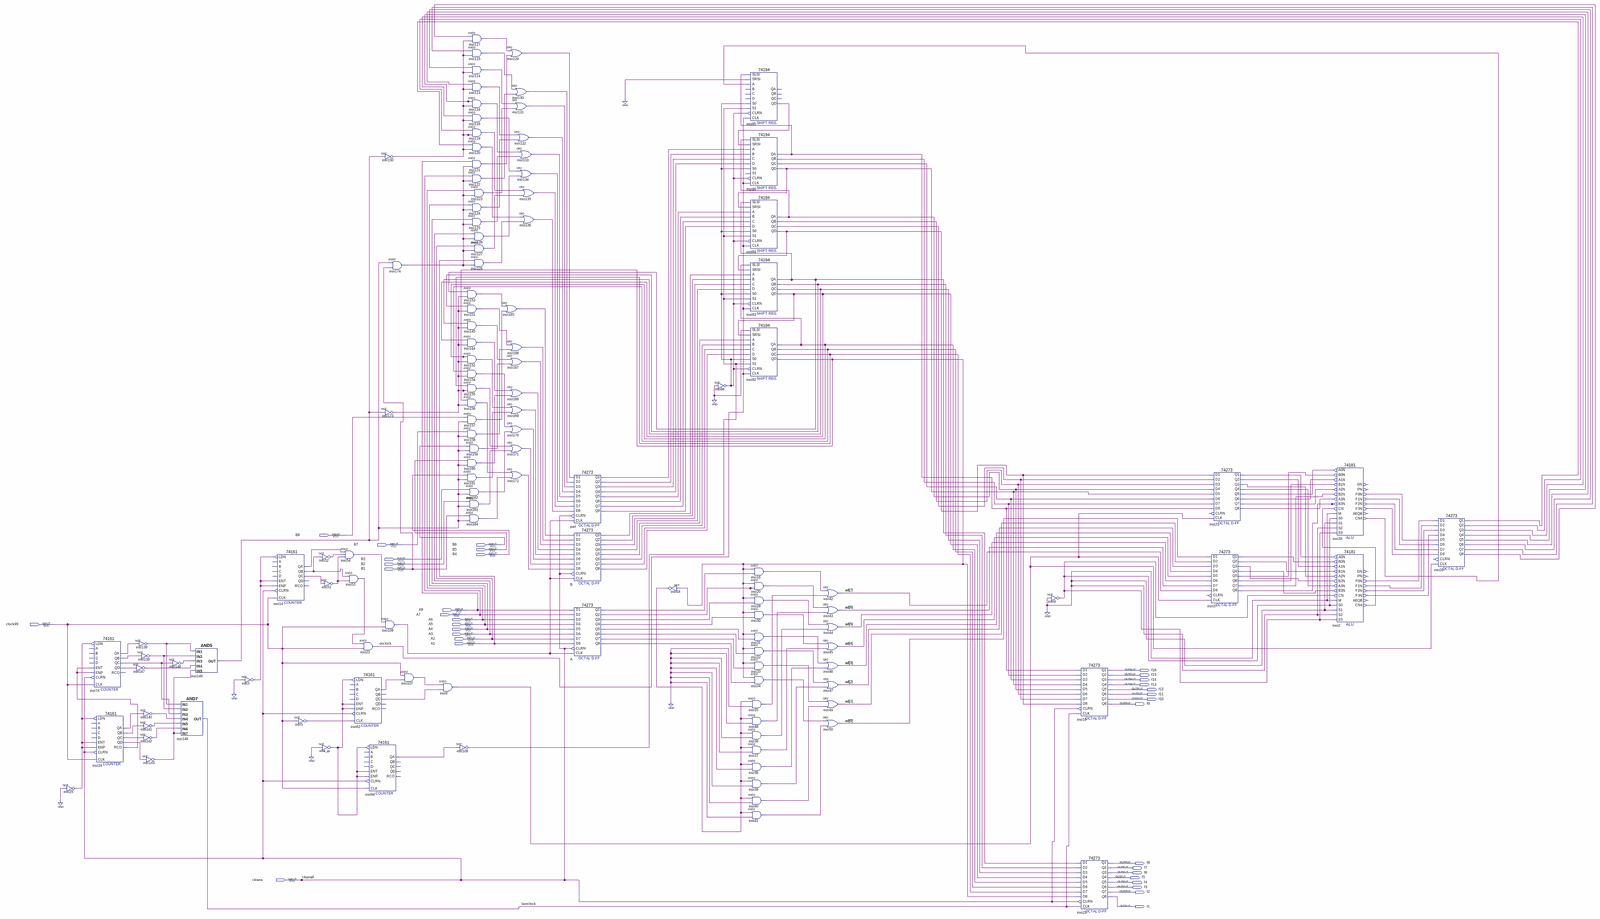
[diagram p0: schematic sheet, whole]
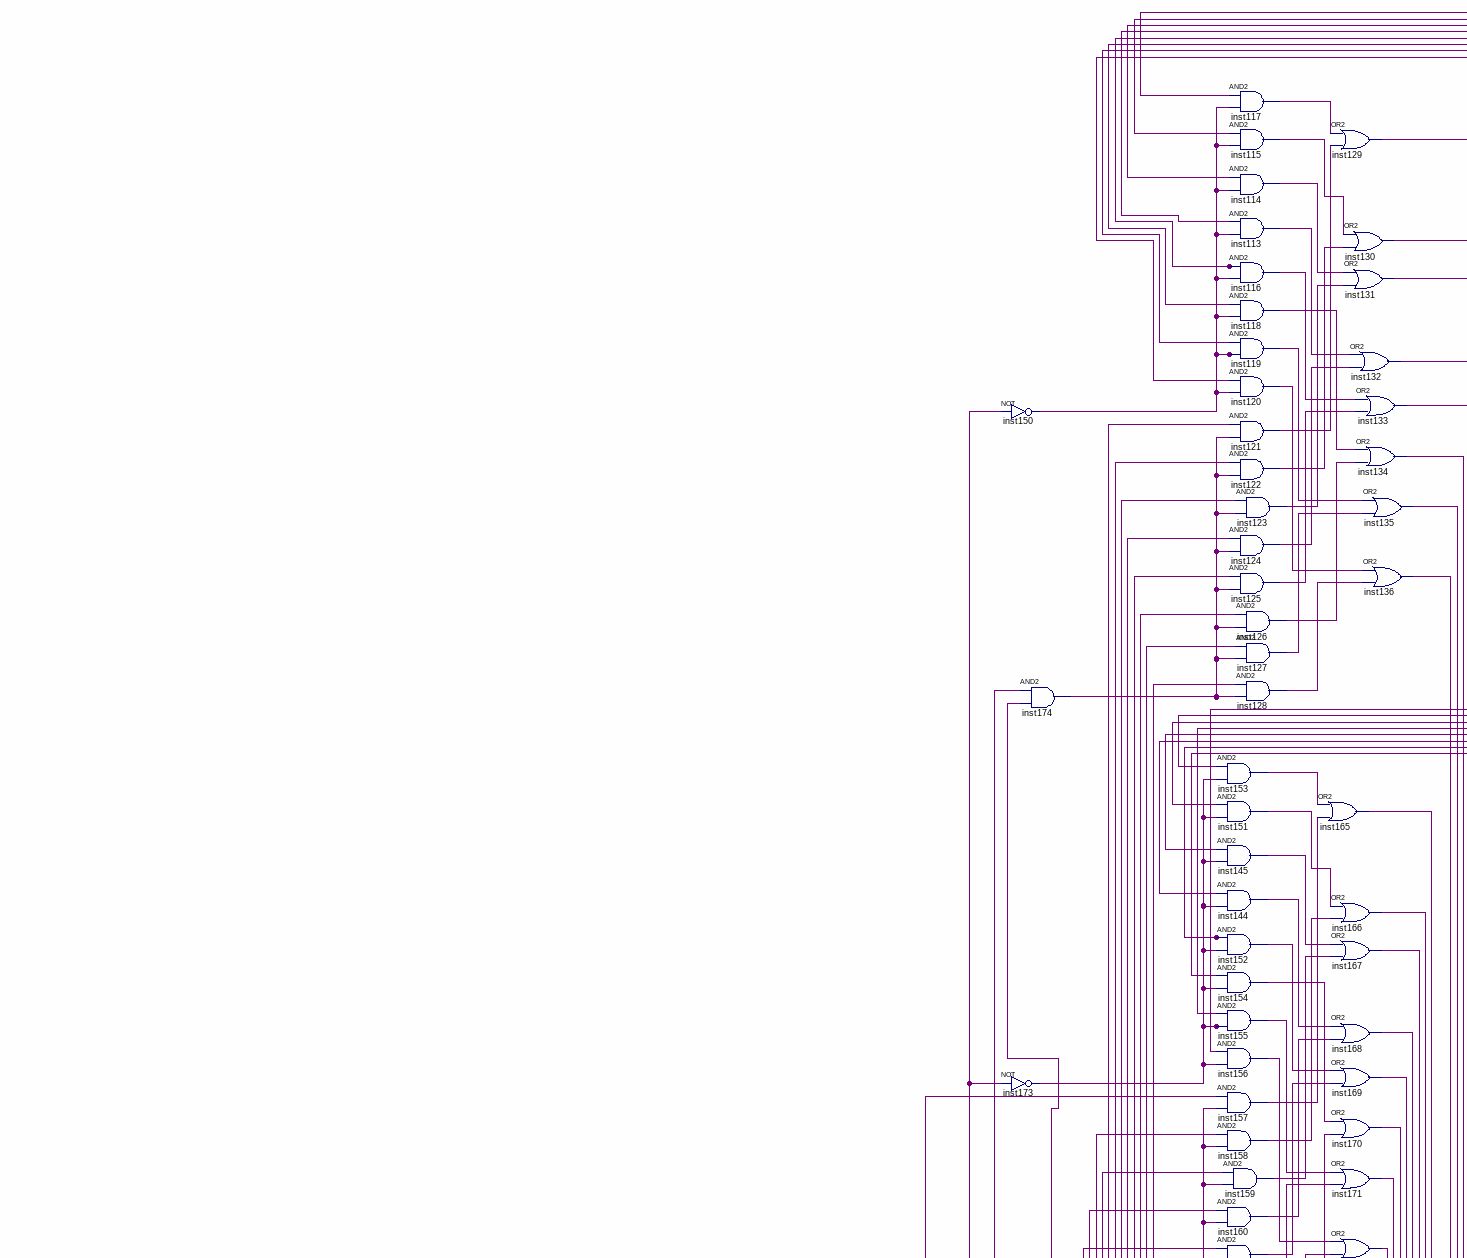
[diagram p1: schematic sheet, upper left part]
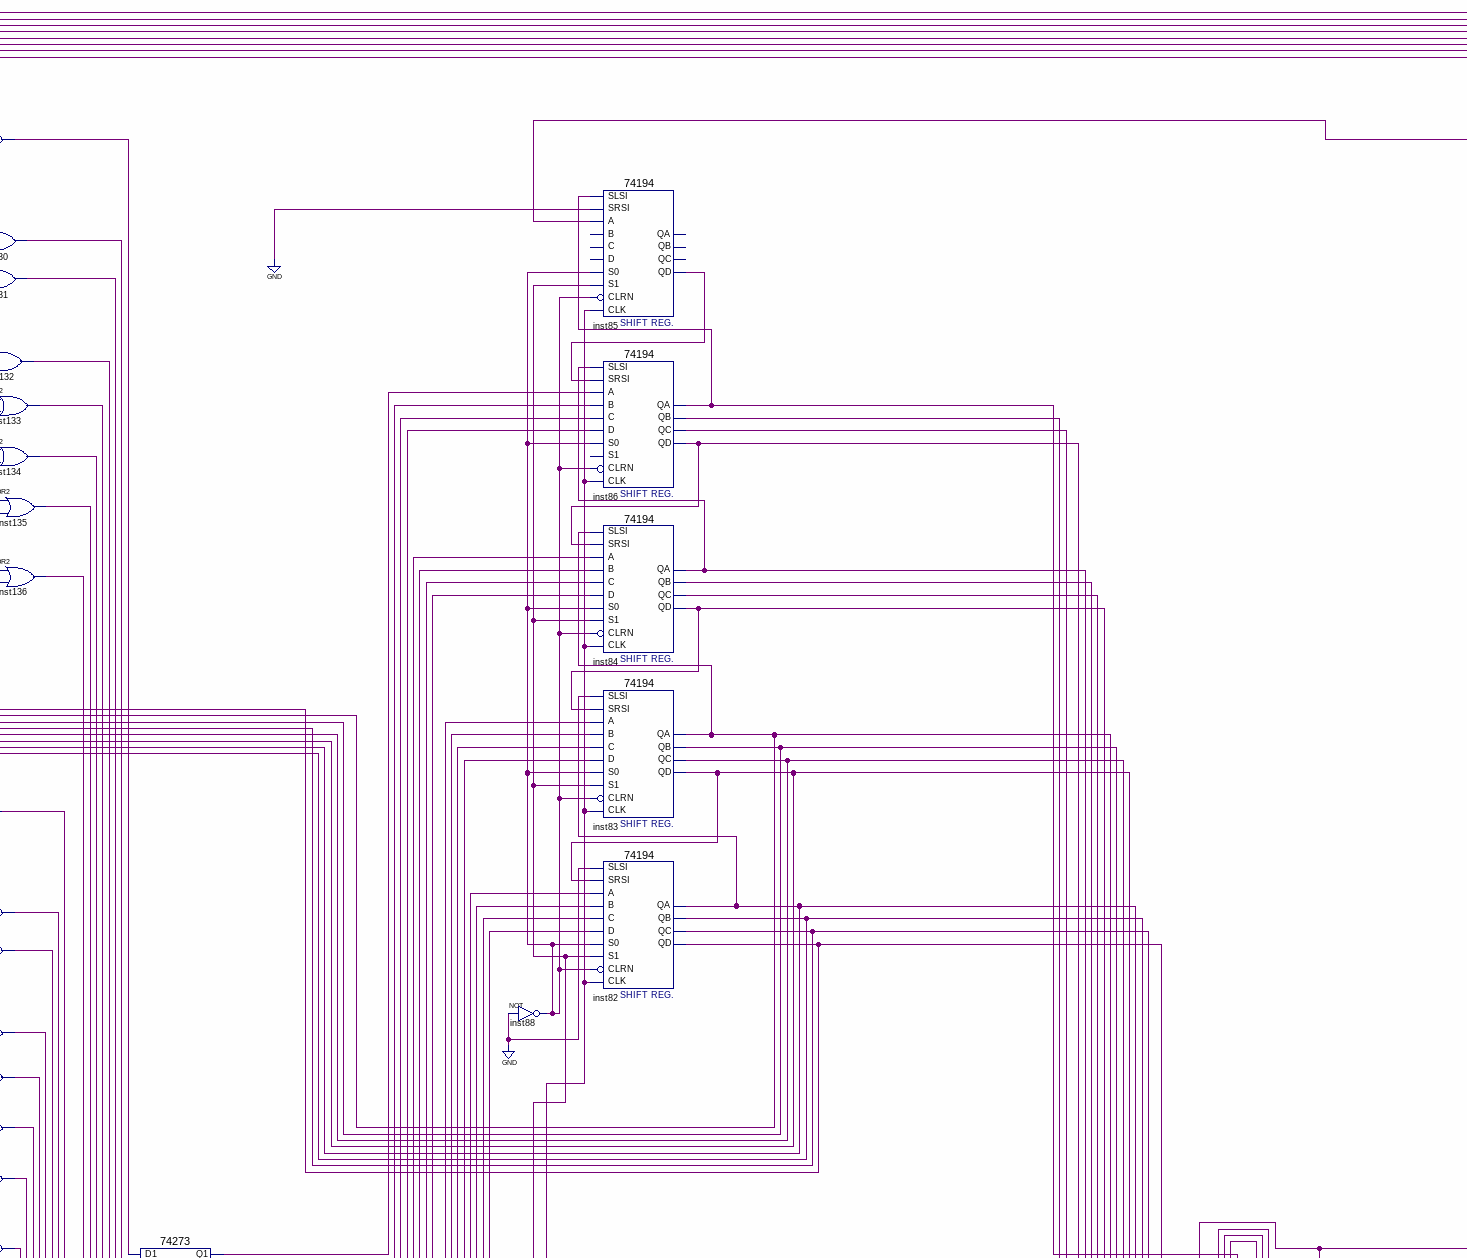
[diagram p2: schematic sheet, upper centre part]
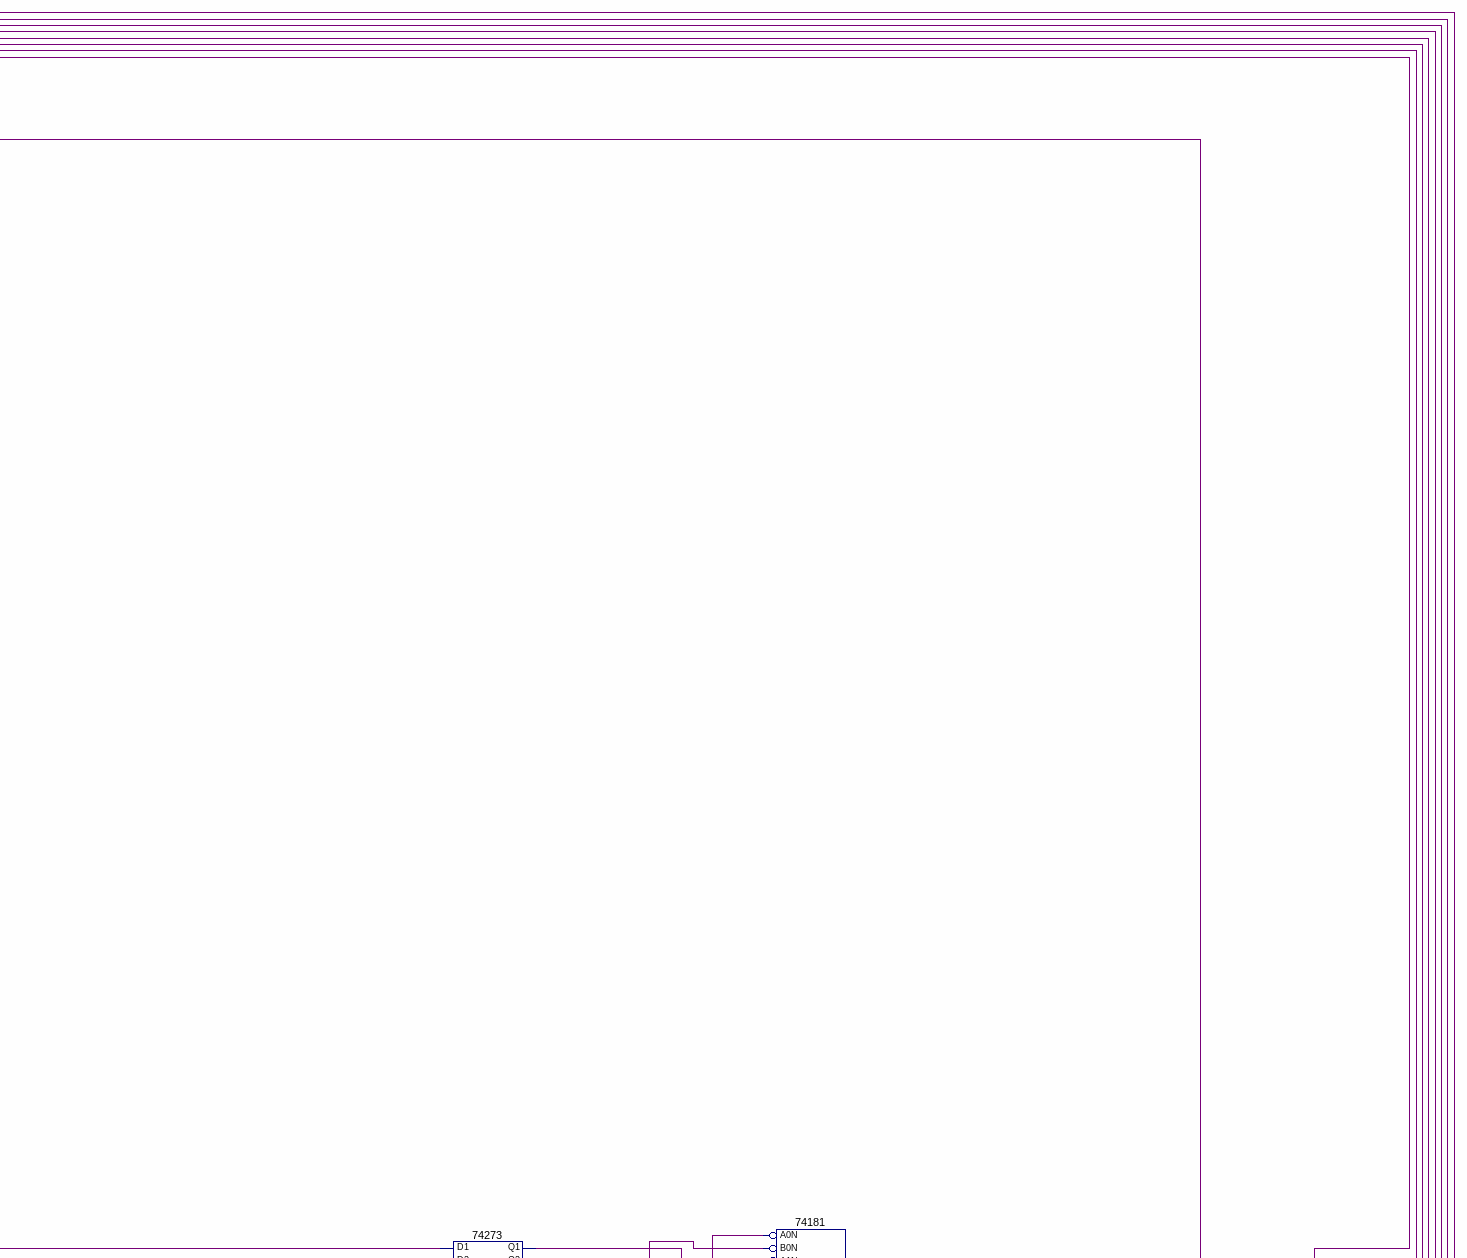
[diagram p3: schematic sheet, upper right part]
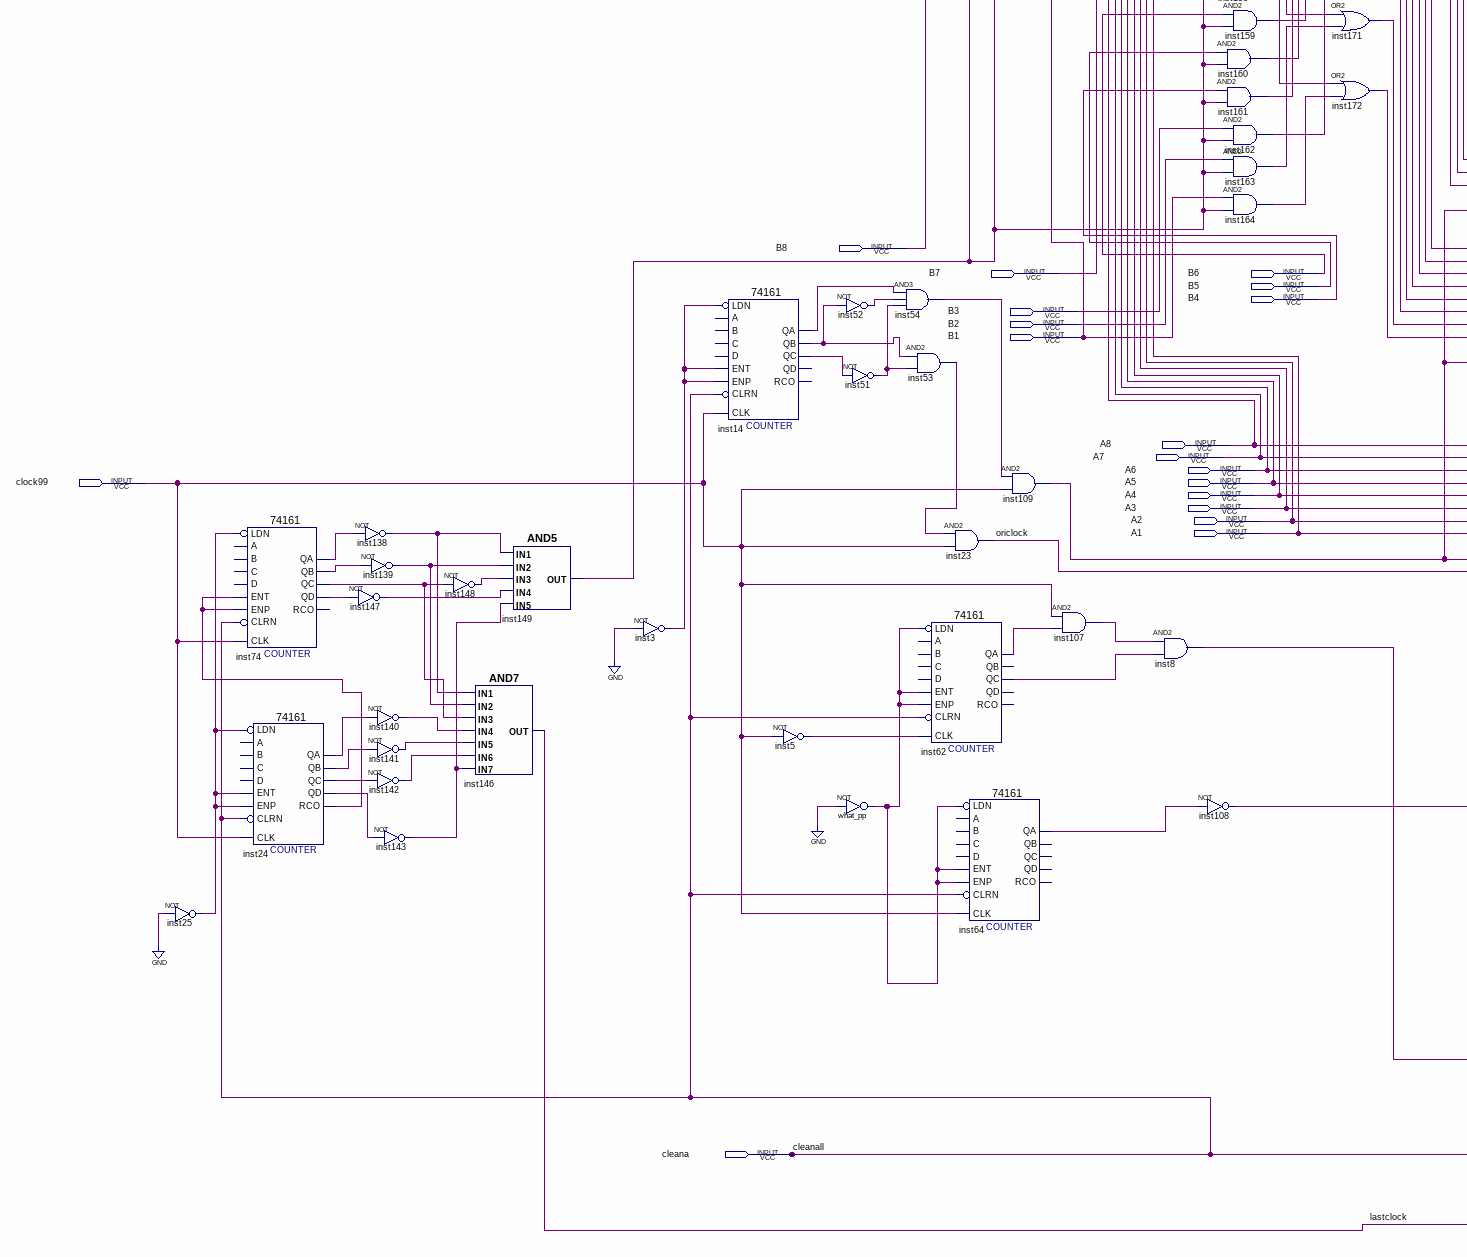
[diagram p4: schematic sheet, lower left part]
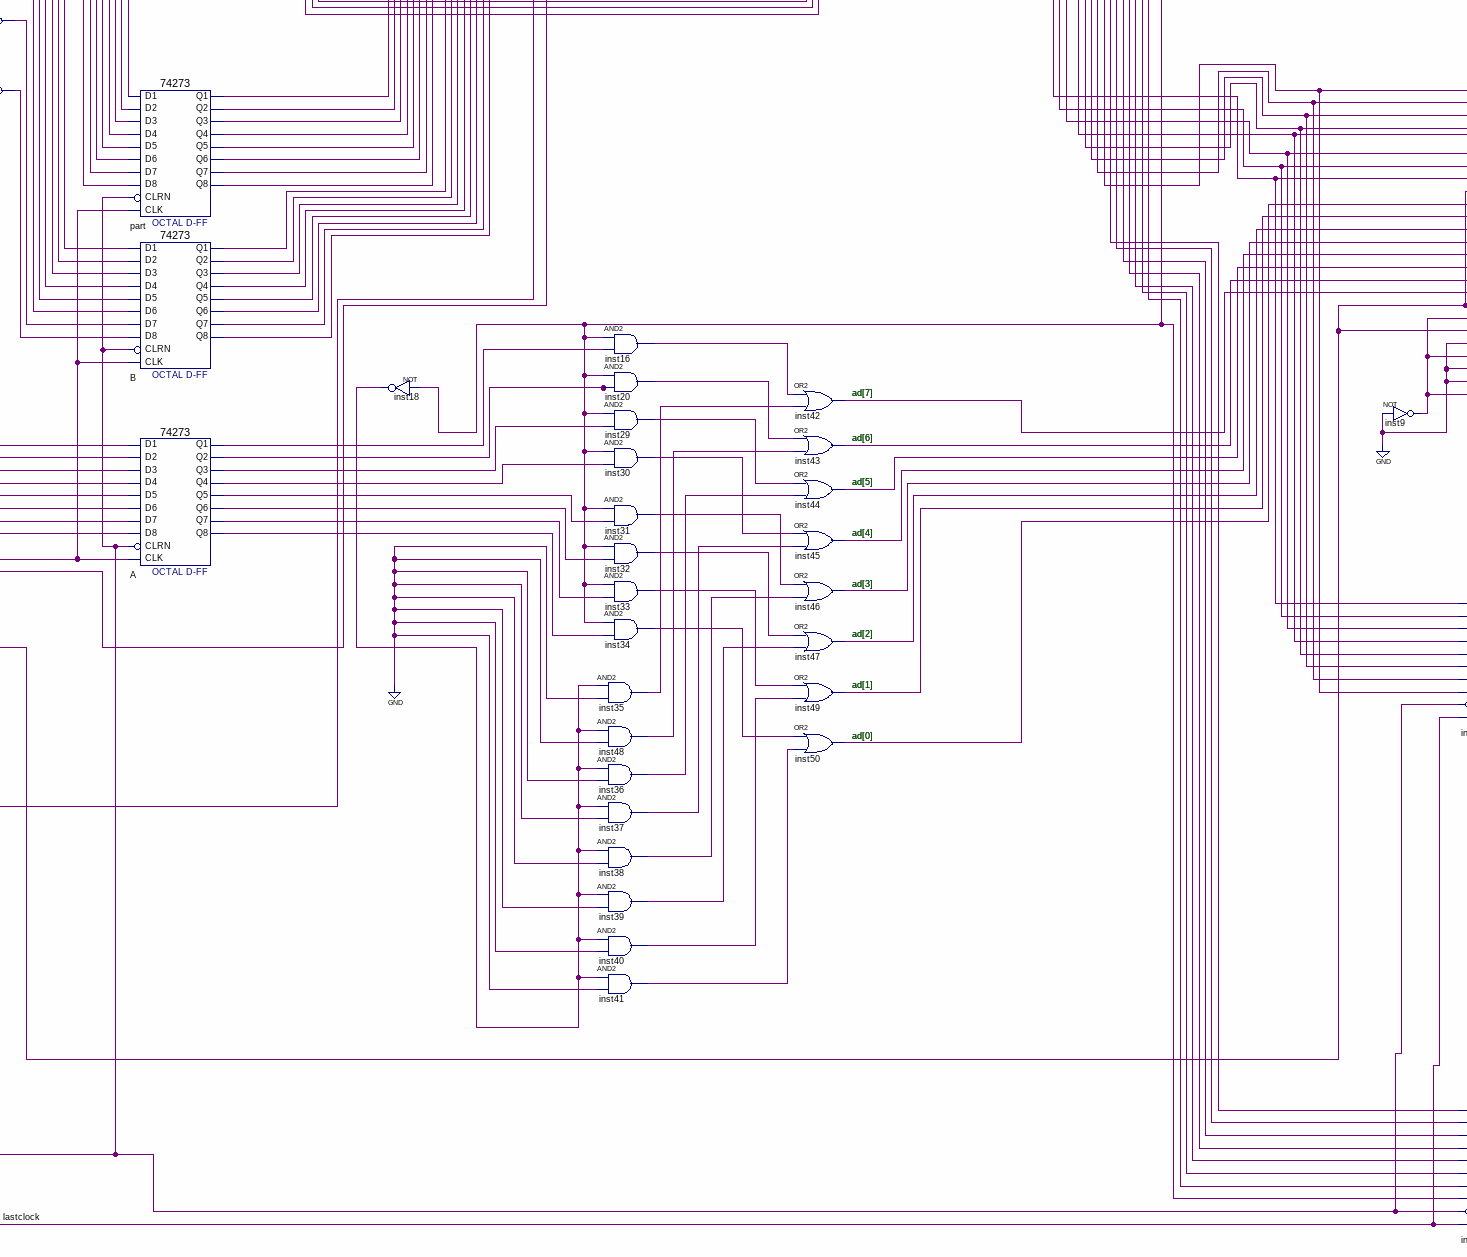
[diagram p5: schematic sheet, lower centre part]
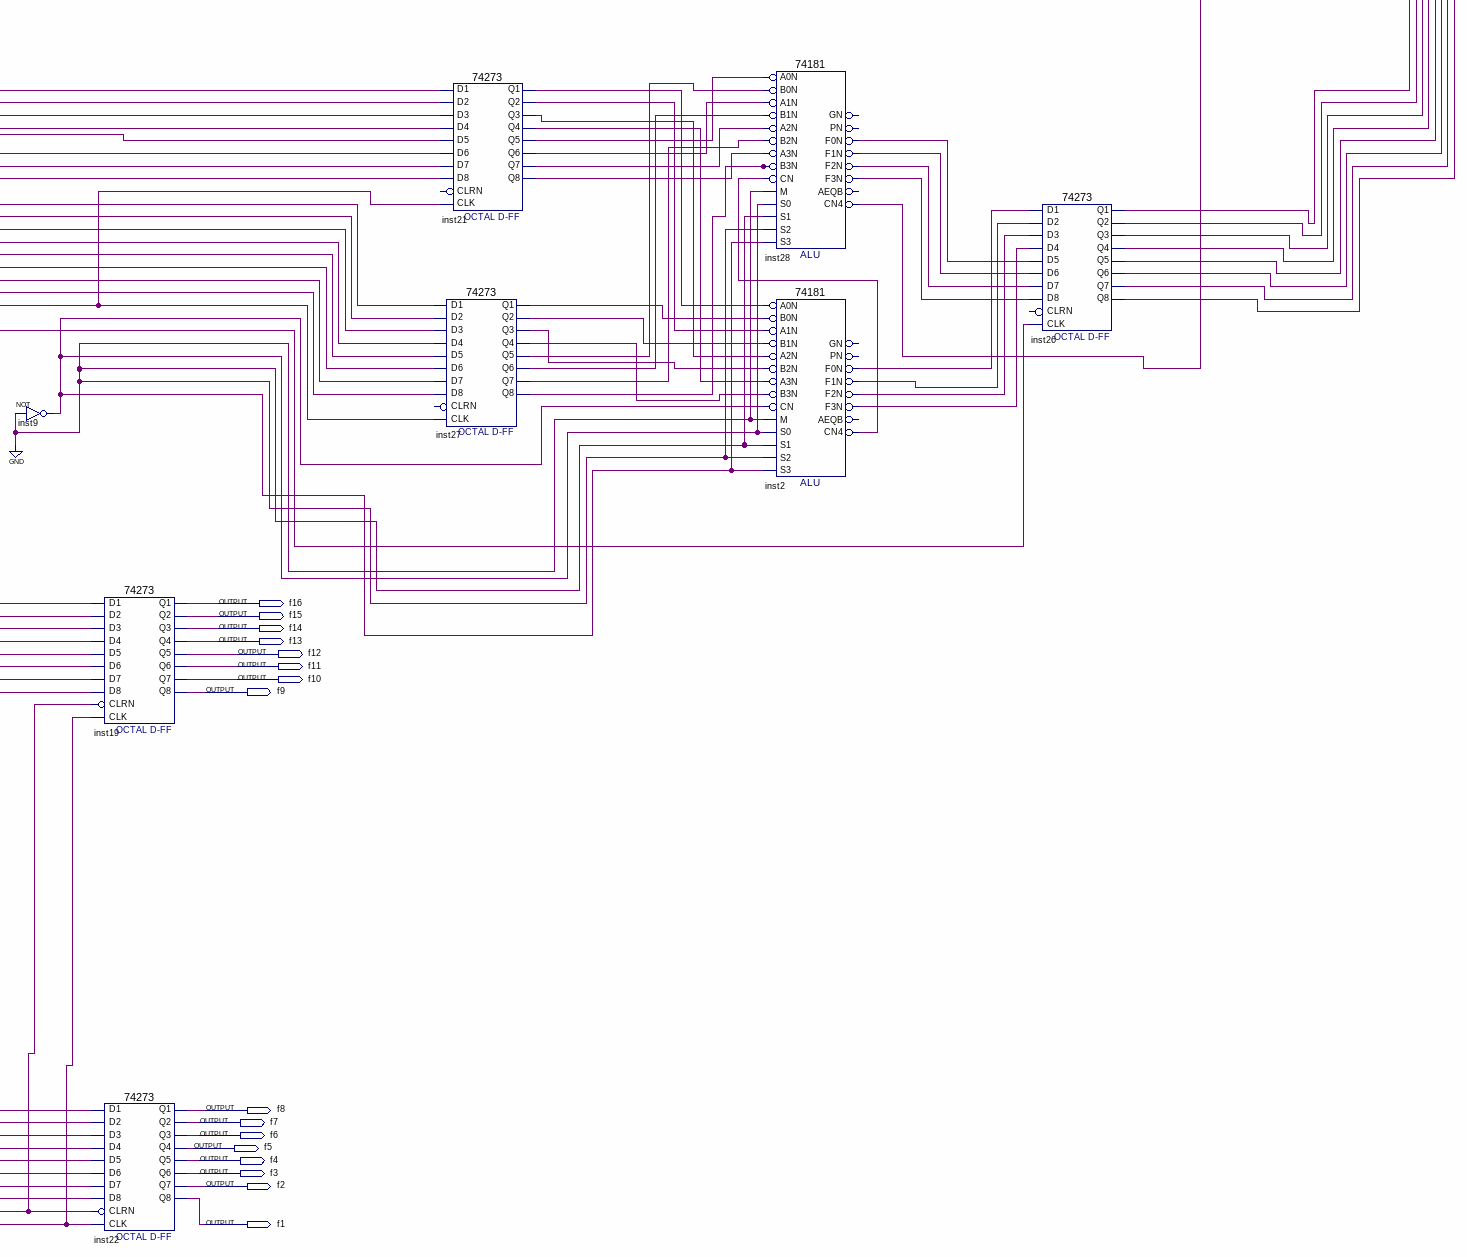
[diagram p6: schematic sheet, lower right part]
// Quartus schematic mutiplyer2.bdf as structural Verilog: 121 symbols, 34 pins
module mutiplyer2 (
  input  B8,
  input  B7,
  input  B6,
  input  B5,
  input  B4,
  input  B3,
  input  B2,
  input  B1,
  input  A8,
  input  A7,
  input  A6,
  input  clock99,
  input  A5,
  input  A4,
  input  A3,
  input  A2,
  input  A1,
  input  cleana,
  output f16,
  output f15,
  output f14,
  output f13,
  output f12,
  output f11,
  output f10,
  output f9,
  output f8,
  output f7,
  output f6,
  output f5,
  output f4,
  output f3,
  output f2,
  output f1
);

  wire A_q1, A_q2, A_q3, A_q4, A_q5, A_q6, A_q7, A_q8, B_q1, B_q2, B_q3, B_q4, B_q5, B_q6, B_q7, B_q8,
       inst2_cn4, inst2_f0n, inst2_f1n, inst2_f2n, inst2_f3n, inst3_out, inst5_out, inst8_out, inst9_out,
       inst14_qa, inst14_qb, inst14_qc, inst16_out, inst18_out, inst20_out, inst21_q1, inst21_q2, inst21_q3,
       inst21_q4, inst21_q5, inst21_q6, inst21_q7, inst21_q8, inst24_qa, inst24_qb, inst24_qc, inst24_qd,
       inst24_rco, inst25_out, inst26_q1, inst26_q2, inst26_q3, inst26_q4, inst26_q5, inst26_q6, inst26_q7,
       inst26_q8, inst27_q1, inst27_q2, inst27_q3, inst27_q4, inst27_q5, inst27_q6, inst27_q7, inst27_q8,
       inst28_cn4, inst28_f0n, inst28_f1n, inst28_f2n, inst28_f3n, inst29_out, inst30_out, inst31_out,
       inst32_out, inst33_out, inst34_out, inst35_out, inst36_out, inst37_out, inst38_out, inst39_out,
       inst40_out, inst41_out, inst48_out, inst51_out, inst52_out, inst53_out, inst54_out, inst62_qa,
       inst62_qc, inst64_qa, inst74_qa, inst74_qb, inst74_qc, inst74_qd, inst82_qa, inst82_qb, inst82_qc,
       inst82_qd, inst83_qa, inst83_qb, inst83_qc, inst83_qd, inst84_qa, inst84_qb, inst84_qc, inst84_qd,
       inst85_qd, inst86_qa, inst86_qb, inst86_qc, inst86_qd, inst88_out, inst107_out, inst108_out,
       inst109_out, inst113_out, inst114_out, inst115_out, inst116_out, inst117_out, inst118_out,
       inst119_out, inst120_out, inst121_out, inst122_out, inst123_out, inst124_out, inst125_out,
       inst126_out, inst127_out, inst128_out, inst129_out, inst130_out, inst131_out, inst132_out,
       inst133_out, inst134_out, inst135_out, inst136_out, inst138_out, inst139_out, inst140_out,
       inst141_out, inst142_out, inst143_out, inst144_out, inst145_out, inst147_out, inst148_out,
       inst149_out, inst150_out, inst151_out, inst152_out, inst153_out, inst154_out, inst155_out,
       inst156_out, inst157_out, inst158_out, inst159_out, inst160_out, inst161_out, inst162_out,
       inst163_out, inst164_out, inst165_out, inst166_out, inst167_out, inst168_out, inst169_out,
       inst170_out, inst171_out, inst172_out, inst173_out, inst174_out, lastclock, oriclock, part_q1,
       part_q2, part_q3, part_q4, part_q5, part_q6, part_q7, part_q8, what_pp_out;
  wire [7:0] ad;

  not inst25 (inst25_out, 1'b0);
  \74161  inst74 (
    .CLRN(cleana), .CLK(clock99), .ENP(inst24_rco), .LDN(inst25_out), .ENT(inst24_rco), .QD(inst74_qd),
    .QC(inst74_qc), .QB(inst74_qb), .QA(inst74_qa));  // open: A, D, B, C, RCO
  \74161  inst24 (
    .CLRN(cleana), .CLK(clock99), .ENP(inst25_out), .LDN(inst25_out), .ENT(inst25_out), .QD(inst24_qd),
    .QC(inst24_qc), .QB(inst24_qb), .QA(inst24_qa), .RCO(inst24_rco));  // open: A, D, B, C
  not inst138 (inst138_out, inst74_qa);
  not inst147 (inst147_out, inst74_qd);
  not inst139 (inst139_out, inst74_qb);
  not inst140 (inst140_out, inst24_qa);
  not inst141 (inst141_out, inst24_qb);
  not inst142 (inst142_out, inst24_qc);
  not inst143 (inst143_out, inst24_qd);
  not inst148 (inst148_out, inst74_qc);
  and inst149 (inst149_out, inst138_out, inst139_out, inst148_out, inst147_out, inst143_out);
  and inst146 (lastclock, inst138_out, inst139_out, inst74_qc, inst140_out, inst141_out, inst142_out, inst143_out);
  not inst3 (inst3_out, 1'b0);
  \74161  inst14 (
    .CLRN(cleana), .CLK(clock99), .ENP(inst3_out), .LDN(inst3_out), .ENT(inst3_out), .QC(inst14_qc),
    .QB(inst14_qb), .QA(inst14_qa));  // open: A, D, B, C, QD, RCO
  not inst5 (inst5_out, clock99);
  not inst52 (inst52_out, inst14_qb);
  not inst51 (inst51_out, inst14_qc);
  not what_pp (what_pp_out, 1'b0);
  and inst54 (inst54_out, inst14_qa, inst52_out, inst51_out);
  and inst53 (inst53_out, inst14_qb, inst51_out);
  and inst23 (oriclock, inst53_out, clock99);
  \74161  inst62 (
    .CLRN(cleana), .CLK(inst5_out), .ENP(what_pp_out), .LDN(what_pp_out), .ENT(what_pp_out), .QC(inst62_qc),
    .QA(inst62_qa));  // open: A, D, B, C, QD, QB, RCO
  \74161  inst64 (
    .CLRN(cleana), .CLK(clock99), .ENP(what_pp_out), .LDN(what_pp_out), .ENT(what_pp_out), .QA(inst64_qa));  // open: A, D, B, C, QD, QC, QB, RCO
  not inst150 (inst150_out, inst149_out);
  not inst173 (inst173_out, inst149_out);
  and inst109 (inst109_out, inst54_out, clock99);
  and inst174 (inst174_out, inst149_out, B1);
  and inst107 (inst107_out, clock99, inst62_qa);
  and inst8 (inst8_out, inst107_out, inst62_qc);
  and inst153 (inst153_out, inst83_qa, inst173_out);
  and inst151 (inst151_out, inst83_qb, inst173_out);
  and inst145 (inst145_out, inst83_qc, inst173_out);
  and inst144 (inst144_out, inst83_qd, inst173_out);
  and inst152 (inst152_out, inst82_qa, inst173_out);
  and inst154 (inst154_out, inst82_qb, inst173_out);
  and inst155 (inst155_out, inst82_qc, inst173_out);
  and inst156 (inst156_out, inst82_qd, inst173_out);
  and inst157 (inst157_out, B8, inst149_out);
  and inst158 (inst158_out, B7, inst149_out);
  and inst160 (inst160_out, B5, inst149_out);
  and inst161 (inst161_out, B4, inst149_out);
  not inst108 (inst108_out, inst64_qa);
  and inst117 (inst117_out, inst26_q8, inst150_out);
  and inst115 (inst115_out, inst26_q7, inst150_out);
  and inst114 (inst114_out, inst26_q6, inst150_out);
  and inst113 (inst113_out, inst26_q5, inst150_out);
  and inst116 (inst116_out, inst26_q4, inst150_out);
  and inst118 (inst118_out, inst26_q3, inst150_out);
  and inst119 (inst119_out, inst26_q2, inst150_out);
  and inst120 (inst120_out, inst26_q1, inst150_out);
  and inst121 (inst121_out, A8, inst174_out);
  and inst122 (inst122_out, A7, inst174_out);
  and inst123 (inst123_out, A6, inst174_out);
  and inst124 (inst124_out, A5, inst174_out);
  and inst125 (inst125_out, A4, inst174_out);
  and inst126 (inst126_out, A3, inst174_out);
  and inst127 (inst127_out, A2, inst174_out);
  and inst128 (inst128_out, A1, inst174_out);
  and inst159 (inst159_out, B6, inst149_out);
  and inst162 (inst162_out, B3, inst149_out);
  and inst163 (inst163_out, B2, inst149_out);
  and inst164 (inst164_out, B1, inst149_out);
  or inst165 (inst165_out, inst153_out, inst157_out);
  or inst129 (inst129_out, inst117_out, inst121_out);
  or inst130 (inst130_out, inst115_out, inst122_out);
  or inst131 (inst131_out, inst114_out, inst123_out);
  or inst132 (inst132_out, inst113_out, inst124_out);
  or inst133 (inst133_out, inst116_out, inst125_out);
  or inst134 (inst134_out, inst118_out, inst126_out);
  or inst135 (inst135_out, inst119_out, inst127_out);
  or inst136 (inst136_out, inst120_out, inst128_out);
  or inst166 (inst166_out, inst151_out, inst158_out);
  or inst167 (inst167_out, inst145_out, inst159_out);
  or inst168 (inst168_out, inst144_out, inst160_out);
  or inst169 (inst169_out, inst152_out, inst161_out);
  or inst170 (inst170_out, inst154_out, inst162_out);
  or inst171 (inst171_out, inst155_out, inst163_out);
  or inst172 (inst172_out, inst156_out, inst164_out);
  \74273  part (
    .D2(inst130_out), .D3(inst131_out), .D1(inst129_out), .D4(inst132_out), .D7(inst135_out),
    .D6(inst134_out), .D5(inst133_out), .D8(inst136_out), .CLK(inst109_out), .CLRN(cleana), .Q4(part_q4),
    .Q1(part_q1), .Q2(part_q2), .Q3(part_q3), .Q6(part_q6), .Q5(part_q5), .Q7(part_q7), .Q8(part_q8));
  \74273  B (
    .D2(inst166_out), .D3(inst167_out), .D1(inst165_out), .D4(inst168_out), .D7(inst171_out),
    .D6(inst170_out), .D5(inst169_out), .D8(inst172_out), .CLK(inst109_out), .CLRN(cleana), .Q4(B_q4),
    .Q1(B_q1), .Q2(B_q2), .Q3(B_q3), .Q6(B_q6), .Q5(B_q5), .Q7(B_q7), .Q8(B_q8));
  \74273  A (
    .D2(A7), .D3(A6), .D1(A8), .D4(A5), .D7(A2), .D6(A3), .D5(A4), .D8(A1), .CLK(inst109_out), .CLRN(cleana),
    .Q4(A_q4), .Q1(A_q1), .Q2(A_q2), .Q3(A_q3), .Q6(A_q6), .Q5(A_q5), .Q7(A_q7), .Q8(A_q8));
  not inst18 (inst18_out, inst82_qd);
  not inst88 (inst88_out, 1'b0);
  \74194  inst85 (
    .SLSI(inst86_qa), .SRSI(1'b0), .CLK(oriclock), .CLRN(inst88_out), .S1(inst108_out), .S0(inst88_out),
    .A(inst28_cn4), .QD(inst85_qd));  // open: B, C, D, QA, QB, QC
  \74194  inst86 (
    .SLSI(inst84_qa), .SRSI(inst85_qd), .B(part_q2), .C(part_q3), .CLK(oriclock), .CLRN(inst88_out),
    .D(part_q4), .S0(inst88_out), .A(part_q1), .QA(inst86_qa), .QB(inst86_qb), .QC(inst86_qc), .QD(inst86_qd));  // open: S1
  \74194  inst84 (
    .SLSI(inst83_qa), .SRSI(inst86_qd), .B(part_q6), .C(part_q7), .CLK(oriclock), .CLRN(inst88_out),
    .D(part_q8), .S1(inst108_out), .S0(inst88_out), .A(part_q5), .QA(inst84_qa), .QB(inst84_qb),
    .QC(inst84_qc), .QD(inst84_qd));
  \74194  inst83 (
    .SLSI(inst82_qa), .SRSI(inst84_qd), .B(B_q2), .C(B_q3), .CLK(oriclock), .CLRN(inst88_out), .D(B_q4),
    .S1(inst108_out), .S0(inst88_out), .A(B_q1), .QA(inst83_qa), .QB(inst83_qb), .QC(inst83_qc),
    .QD(inst83_qd));
  \74194  inst82 (
    .SLSI(1'b0), .SRSI(inst83_qd), .B(B_q6), .C(B_q7), .CLK(oriclock), .CLRN(inst88_out), .D(B_q8),
    .S1(inst108_out), .S0(inst88_out), .A(B_q5), .QA(inst82_qa), .QB(inst82_qb), .QC(inst82_qc),
    .QD(inst82_qd));
  and inst16 (inst16_out, inst82_qd, A_q1);
  and inst20 (inst20_out, inst82_qd, A_q2);
  and inst29 (inst29_out, inst82_qd, A_q3);
  and inst30 (inst30_out, inst82_qd, A_q4);
  and inst31 (inst31_out, inst82_qd, A_q5);
  and inst32 (inst32_out, inst82_qd, A_q6);
  and inst33 (inst33_out, inst82_qd, A_q7);
  and inst34 (inst34_out, inst82_qd, A_q8);
  and inst35 (inst35_out, inst18_out, 1'b0);
  and inst48 (inst48_out, inst18_out, 1'b0);
  and inst36 (inst36_out, inst18_out, 1'b0);
  and inst37 (inst37_out, inst18_out, 1'b0);
  and inst38 (inst38_out, inst18_out, 1'b0);
  and inst39 (inst39_out, inst18_out, 1'b0);
  and inst40 (inst40_out, inst18_out, 1'b0);
  and inst41 (inst41_out, inst18_out, 1'b0);
  or inst42 (ad[7], inst16_out, inst35_out);
  or inst43 (ad[6], inst20_out, inst48_out);
  or inst44 (ad[5], inst29_out, inst36_out);
  or inst45 (ad[4], inst30_out, inst37_out);
  or inst46 (ad[3], inst31_out, inst38_out);
  or inst47 (ad[2], inst32_out, inst39_out);
  or inst49 (ad[1], inst33_out, inst40_out);
  or inst50 (ad[0], inst34_out, inst41_out);
  not inst9 (inst9_out, 1'b0);
  \74273  inst19 (
    .D2(inst86_qb), .D3(inst86_qc), .D1(inst86_qa), .D4(inst86_qd), .D7(inst84_qc), .D6(inst84_qb),
    .D5(inst84_qa), .D8(inst84_qd), .CLK(lastclock), .CLRN(cleana), .Q4(f13), .Q1(f16), .Q2(f15), .Q3(f14),
    .Q6(f11), .Q5(f12), .Q7(f10), .Q8(f9));
  \74273  inst22 (
    .D2(inst83_qb), .D3(inst83_qc), .D1(inst83_qa), .D4(inst83_qd), .D7(inst82_qc), .D6(inst82_qb),
    .D5(inst82_qa), .D8(inst82_qd), .CLK(lastclock), .CLRN(cleana), .Q4(f5), .Q1(f8), .Q2(f7), .Q3(f6),
    .Q6(f3), .Q5(f4), .Q7(f2), .Q8(f1));
  \74273  inst21 (
    .D2(inst84_qc), .D3(inst84_qb), .D1(inst84_qd), .D4(inst84_qa), .D7(inst86_qb), .D6(inst86_qc),
    .D5(inst86_qd), .D8(inst86_qa), .CLK(inst8_out), .Q4(inst21_q4), .Q1(inst21_q1), .Q2(inst21_q2),
    .Q3(inst21_q3), .Q6(inst21_q6), .Q5(inst21_q5), .Q7(inst21_q7), .Q8(inst21_q8));  // open: CLRN
  \74273  inst27 (
    .D2(ad[1]), .D3(ad[2]), .D1(ad[0]), .D4(ad[3]), .D7(ad[6]), .D6(ad[5]), .D5(ad[4]), .D8(ad[7]),
    .CLK(inst8_out), .Q4(inst27_q4), .Q1(inst27_q1), .Q2(inst27_q2), .Q3(inst27_q3), .Q6(inst27_q6),
    .Q5(inst27_q5), .Q7(inst27_q7), .Q8(inst27_q8));  // open: CLRN
  \74181  inst28 (
    .B0N(inst27_q5), .A0N(inst21_q5), .A1N(inst21_q6), .B1N(inst27_q6), .A3N(inst21_q8), .B2N(inst27_q7),
    .A2N(inst21_q7), .M(1'b0), .CN(inst2_cn4), .B3N(inst27_q8), .S2(1'b0), .S1(1'b0), .S0(inst9_out),
    .S3(inst9_out), .F3N(inst28_f3n), .F1N(inst28_f1n), .F0N(inst28_f0n), .CN4(inst28_cn4), .F2N(inst28_f2n));  // open: PN, GN, AEQB
  \74181  inst2 (
    .B0N(inst27_q1), .A0N(inst21_q1), .A1N(inst21_q2), .B1N(inst27_q2), .A3N(inst21_q4), .B2N(inst27_q3),
    .A2N(inst21_q3), .M(1'b0), .CN(inst9_out), .B3N(inst27_q4), .S2(1'b0), .S1(1'b0), .S0(inst9_out),
    .S3(inst9_out), .F3N(inst2_f3n), .F1N(inst2_f1n), .F0N(inst2_f0n), .CN4(inst2_cn4), .F2N(inst2_f2n));  // open: PN, GN, AEQB
  \74273  inst26 (
    .D2(inst2_f1n), .D3(inst2_f2n), .D1(inst2_f0n), .D4(inst2_f3n), .D7(inst28_f2n), .D6(inst28_f1n),
    .D5(inst28_f0n), .D8(inst28_f3n), .CLK(inst8_out), .Q4(inst26_q4), .Q1(inst26_q1), .Q2(inst26_q2),
    .Q3(inst26_q3), .Q6(inst26_q6), .Q5(inst26_q5), .Q7(inst26_q7), .Q8(inst26_q8));  // open: CLRN

  // Other names for the same wires on the sheet: cleanall = cleana

  // Notes on the sheet:
  //   ad[7]
  //   ad[6]
  //   ad[5]
  //   ad[4]
  //   ad[3]
  //   ad[2]
  //   ad[1]
  //   ad[0]
endmodule
